# EAGLE schematic shift_serial (EAGLE 6.0)
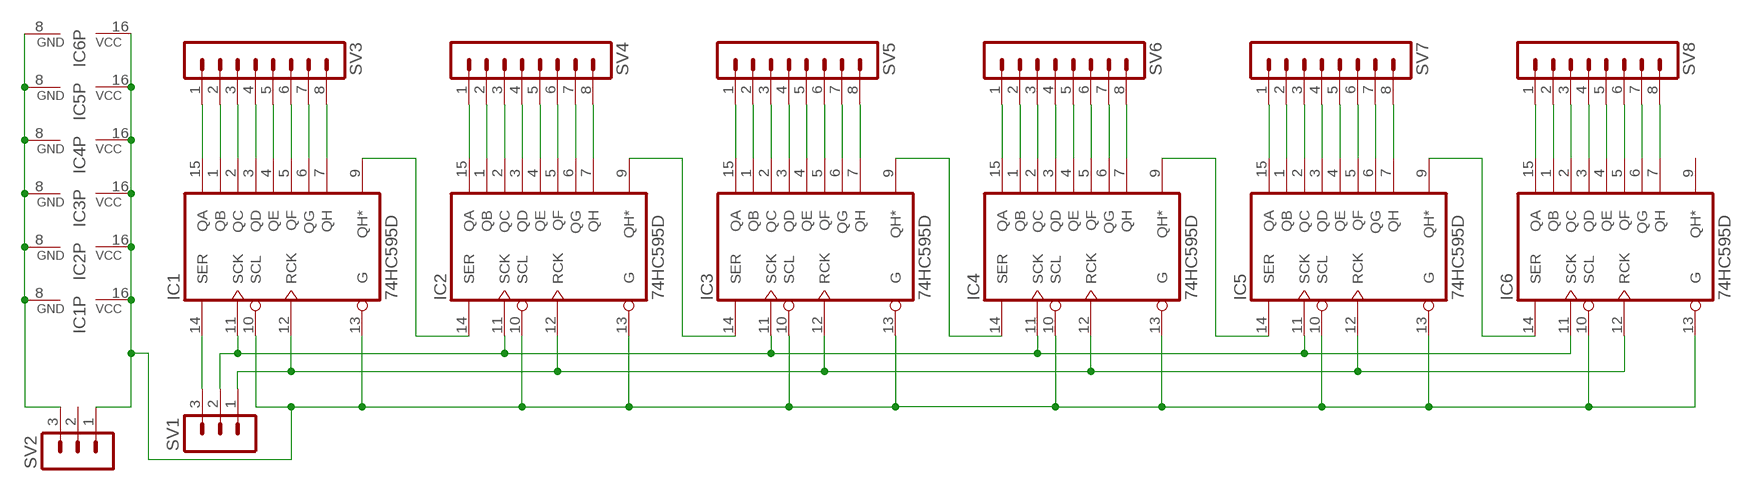
[diagram p0: schematic, sheet 1]

## Parts
IC1  74HC595D  [SO16]
IC2  74HC595D  [SO16]
IC3  74HC595D  [SO16]
IC4  74HC595D  [SO16]
IC5  74HC595D  [SO16]
IC6  74HC595D  [SO16]
SV1  MA03-1  [MA03-1]
SV2  MA03-1  [MA03-1]
SV3  MA08-1  [MA08-1]
SV4  MA08-1  [MA08-1]
SV5  MA08-1  [MA08-1]
SV6  MA08-1  [MA08-1]
SV7  MA08-1  [MA08-1]
SV8  MA08-1  [MA08-1]

## Nets
N$1: IC1.9(QH*) IC2.14(SER)
N$2: IC2.9(QH*) IC3.14(SER)
N$3: IC3.9(QH*) IC4.14(SER)
N$4: IC4.9(QH*) IC5.14(SER)
N$5: IC5.9(QH*) IC6.14(SER)
N$6: IC1.15(QA) SV3.1
N$7: IC1.1(QB) SV3.2
N$8: IC1.2(QC) SV3.3
N$9: IC1.3(QD) SV3.4
N$10: IC1.4(QE) SV3.5
N$11: IC1.5(QF) SV3.6
N$12: IC1.6(QG) SV3.7
N$13: IC1.7(QH) SV3.8
N$14: IC2.15(QA) SV4.1
N$15: IC2.1(QB) SV4.2
N$16: IC2.2(QC) SV4.3
N$17: IC2.3(QD) SV4.4
N$18: IC2.4(QE) SV4.5
N$19: IC2.5(QF) SV4.6
N$20: IC2.6(QG) SV4.7
N$21: IC2.7(QH) SV4.8
N$22: IC3.15(QA) SV5.1
N$23: IC3.1(QB) SV5.2
N$24: IC3.2(QC) SV5.3
N$25: IC3.3(QD) SV5.4
N$26: IC3.4(QE) SV5.5
N$27: IC3.5(QF) SV5.6
N$28: IC3.6(QG) SV5.7
N$29: IC3.7(QH) SV5.8
N$30: IC4.15(QA) SV6.1
N$31: IC4.1(QB) SV6.2
N$32: IC4.2(QC) SV6.3
N$33: IC4.3(QD) SV6.4
N$34: IC4.4(QE) SV6.5
N$35: IC4.5(QF) SV6.6
N$36: IC4.6(QG) SV6.7
N$37: IC4.7(QH) SV6.8
N$38: IC5.15(QA) SV7.1
N$39: IC5.1(QB) SV7.2
N$40: IC5.2(QC) SV7.3
N$41: IC5.3(QD) SV7.4
N$42: IC5.4(QE) SV7.5
N$43: IC5.5(QF) SV7.6
N$44: IC5.6(QG) SV7.7
N$45: IC5.7(QH) SV7.8
N$46: IC6.15(QA) SV8.1
N$47: IC6.1(QB) SV8.2
N$48: IC6.2(QC) SV8.3
N$49: IC6.3(QD) SV8.4
N$50: IC6.4(QE) SV8.5
N$51: IC6.5(QF) SV8.6
N$52: IC6.6(QG) SV8.7
N$53: IC6.7(QH) SV8.8
N$54: IC1.14(SER) SV1.3
N$55: IC1.12(RCK) IC2.12(RCK) IC3.12(RCK) IC4.12(RCK) IC5.12(RCK) IC6.12(RCK) SV1.1
N$56: IC1.11(SCK) IC2.11(SCK) IC3.11(SCK) IC4.11(SCK) IC5.11(SCK) IC6.11(SCK) SV1.2
N$58: IC1.8(GND) IC2.8(GND) IC3.8(GND) IC4.8(GND) IC5.8(GND) IC6.8(GND) SV2.3
N$59: IC1.10(SCL) IC1.13(G) IC1.16(VCC) IC2.10(SCL) IC2.13(G) IC2.16(VCC) IC3.10(SCL) IC3.13(G) IC3.16(VCC) IC4.10(SCL) IC4.13(G) IC4.16(VCC) IC5.10(SCL) IC5.13(G) IC5.16(VCC) IC6.10(SCL) IC6.13(G) IC6.16(VCC) SV2.1
Unconnected: IC6.9(QH*) SV2.2

## Library data of the parts
IC1-IC6 = 74xx-eu:74*595: 8-bit SHIFT REGISTER, output latch
SV1 SV2 = con-lstb:MA03-1: PIN HEADER; OC_FARNELL: unknown; OC_NEWARK: unknown
SV3-SV8 = con-lstb:MA08-1: PIN HEADER; OC_FARNELL: unknown; OC_NEWARK: unknown